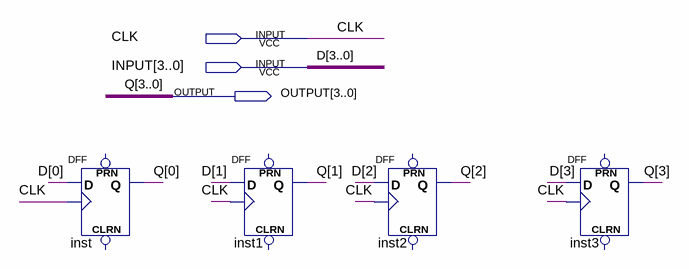
[diagram p0: schematic sheet]
// Quartus schematic Reg4Bits.bdf as structural Verilog: 4 symbols, 3 pins
module Reg4Bits (
  input  CLK,
  input  [3:0] INPUT,
  output [3:0] OUTPUT
);

  DFF inst (.CLK(CLK), .D(INPUT[0]), .Q(OUTPUT[0]));  // open: CLRN, PRN
  DFF inst1 (.CLK(CLK), .D(INPUT[1]), .Q(OUTPUT[1]));  // open: CLRN, PRN
  DFF inst2 (.CLK(CLK), .D(INPUT[2]), .Q(OUTPUT[2]));  // open: CLRN, PRN
  DFF inst3 (.CLK(CLK), .D(INPUT[3]), .Q(OUTPUT[3]));  // open: CLRN, PRN

  // Other names for the same wires on the sheet: D[3:0] = INPUT; Q[3:0] = OUTPUT
endmodule
